# EAGLE design Own_RPi.Expansionboard.pro_1.0_Final_AR (EAGLE 9.6.2)
COMPANY: ADAFRUIT INDUSTRIES; DRAWN: KTOWN; REV: A; YEAR: 2019
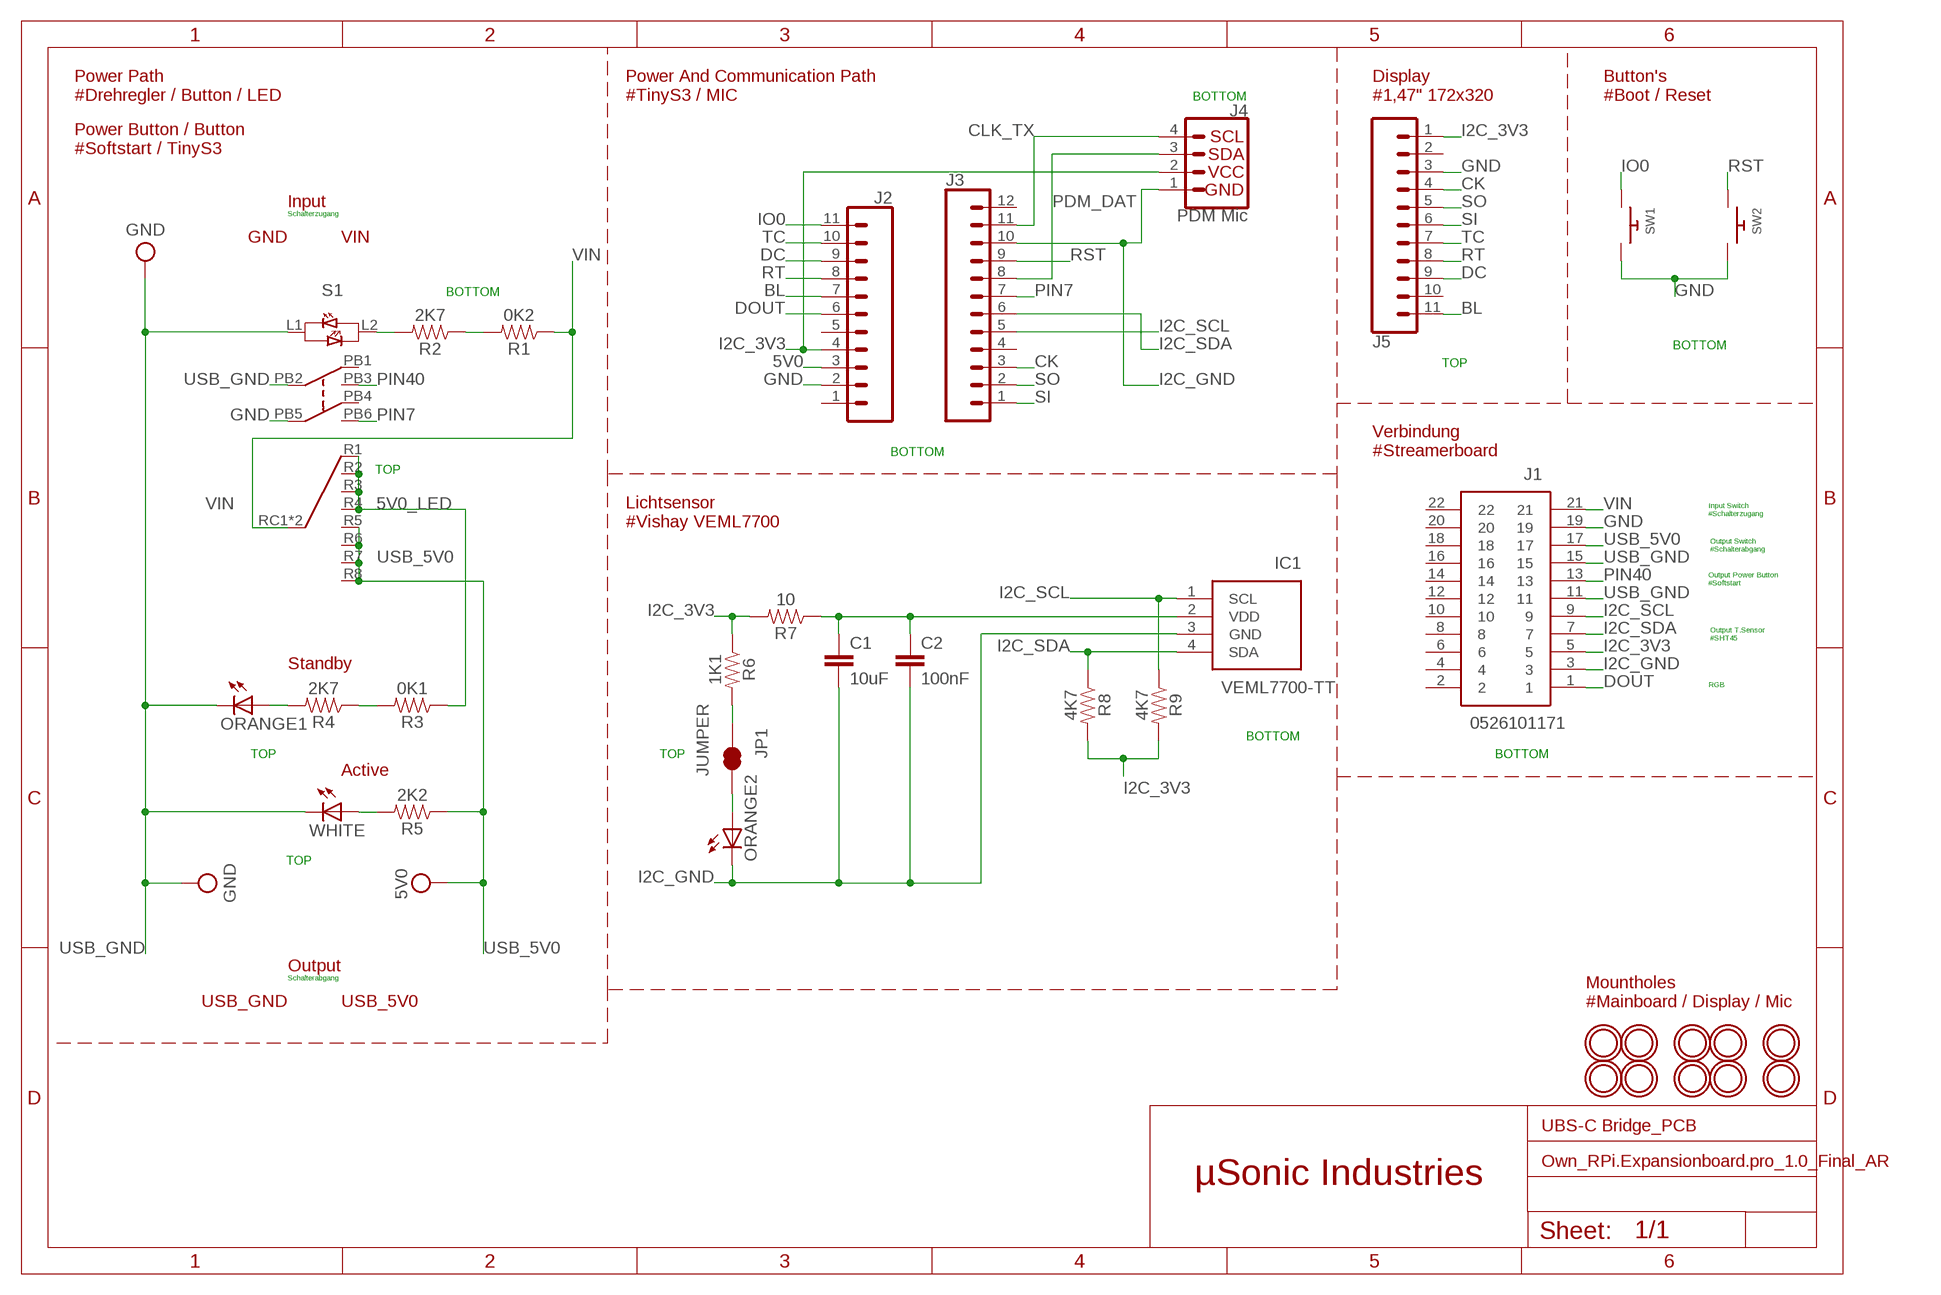
[diagram p0: schematic, sheet 1]

## Parts
C1  10uF  1.0UF-0805-25V-10%  [0805]
C2  100nF  1.0UF-0805-25V-10%  [0805]
IC1  VEML7700-TT  [VEML7700]
J1  0526101171  [0526101171]
J2  CONN_111X11_NO_SILK  [1X11_NO_SILK]
J3  CONN_12NO_SILK  [1X12_NO_SILK]
J4  PDM Mic  QWIIC_CONNECTOROWN  [JST04_1MM_VERT]
J5  CONN_111X11_NO_SILK  [1X11_NO_SILK]
JP1  JUMPER  JUMPER-SMT_2_NC_TRACE_SILK  [SMT-JUMPER_2_NC_TRACE_SILK]
ORANGE1  LEDCHIPLED_0805  [CHIPLED_0805]
ORANGE2  LEDCHIPLED_0805  [CHIPLED_0805]
R1  0K2  RESISTOR0805  [0805]
R2  2K7  RESISTOR0805  [0805]
R3  0K1  RESISTOR0805  [0805]
R4  2K7  RESISTOR0805  [0805]
R5  2K2  RESISTOR0805  [0805]
R6  1K1  RESISTOR0805  [0805]
R7  10  RESISTOR0805  [0805]
R8  4K7  RESISTOR0805  [0805]
R9  4K7  RESISTOR0805  [0805]
S1  481RV12172100  [481RV12172100]
SW1  SWITCH_PUSHBUTTONSF_OWN  [OWN_TACT_PANA-EVQ]
SW2  SWITCH_PUSHBUTTONSF_OWN  [OWN_TACT_PANA-EVQ]
U$1  MOUNTINGHOLE2.5  [MOUNTINGHOLE_2.5_PLATED]
U$2  MOUNTINGHOLE2.5  [MOUNTINGHOLE_2.5_PLATED]
U$3  MOUNTINGHOLE2.5  [MOUNTINGHOLE_2.5_PLATED]
U$5  MOUNTINGHOLE2.5  [MOUNTINGHOLE_2.5_PLATED]
U$8  MOUNTINGHOLE2.5  [MOUNTINGHOLE_2.5_PLATED]
U$9  MOUNTINGHOLE2.5  [MOUNTINGHOLE_2.5_PLATED]
U$13  MOUNTINGHOLE2.5  [MOUNTINGHOLE_2.5_PLATED]
U$14  MOUNTINGHOLE2.5  [MOUNTINGHOLE_2.5_PLATED]
U$15  MOUNTINGHOLE2.5  [MOUNTINGHOLE_2.5_PLATED]
U$16  MOUNTINGHOLE2.5  [MOUNTINGHOLE_2.5_PLATED]
WHITE  LEDCHIPLED_0805  [CHIPLED_0805]

## Nets
5V0: J2.3
5V0_LED: R3.1 S1.R1 S1.R2 S1.R3 S1.R4
BL: J2.7 J5.11
CK: J3.3 J5.4
CLK_TX: J3.11 J4.4
DC: J2.9 J5.9
DOUT: J1.1 J2.6
GND: J1.19 J2.2 J5.3 S1.PB5 SW1.P$2 SW2.P$2
I2C_3V3: J1.5 J2.4 J4.2 J5.1 R6.1 R7.2 R8.2 R9.2
I2C_GND: C1.2 C2.2 IC1.3(GND) J1.3 J3.10 J4.1 ORANGE2.C
I2C_SCL: IC1.1(SCL) J1.9 J3.5 R9.1
I2C_SDA: IC1.4(SDA) J1.7 J3.6 R8.1
IO0: J2.11 SW1.P$1
N$1: JP1.2 R6.2
N$2: R1.2 R2.1
N$3: R2.2 S1.L2
N$4: C1.1 C2.1 IC1.2(VDD) R7.1
N$5: R3.2 R4.1
N$6: R5.2 WHITE.A
N$7: ORANGE1.A R4.2
N$8: JP1.1 ORANGE2.A
PDM_DAT: J3.8 J4.3
PIN7: J3.7 S1.PB6
PIN40: J1.13 S1.PB3
RST: J3.9 SW2.P$1
RT: J2.8 J5.8
SI: J3.1 J5.6
SO: J3.2 J5.5
TC: J2.10 J5.7
USB_5V0: J1.17 R5.1 S1.R5 S1.R6 S1.R7 S1.R8 ; supply symbol labelled 5V0
USB_GND: J1.11 J1.15 ORANGE1.C S1.L1 S1.PB2 WHITE.C ; supply symbol labelled GND
VIN: J1.21 R1.1 S1.RC1(C1) S1.RC2(C1)
Unconnected: J1.2 J1.4 J1.6 J1.8 J1.10 J1.12 J1.14 J1.16 J1.18 J1.20 J1.22 J2.1 J2.5 J3.4 J3.12 J5.2 J5.10 S1.PB1 S1.PB4

## Notes on the sheet
- Power Path
  #Drehregler / Button / LED
- Power And Communication Path
  #TinyS3 / MIC
- BOTTOM
- Display
  #1,47" 172x320
- Button's
  #Boot / Reset
- Power Button / Button
  #Softstart / TinyS3
- Input
- Schalterzugang
- GND | VIN
- BOTTOM
- BOTTOM
- TOP
- BOTTOM
- Verbindung
  #Streamerboard
- TOP
- Input Switch
  #Schalterzugang
- Lichtsensor
  #Vishay VEML7700
- Output Switch
  #Schalterabgang
- Output Power Button
  #Softstart
- Output T.Sensor
  #SHT45
- Standby
- RGB
- BOTTOM
- TOP | TOP | BOTTOM
- Active
- TOP
- Output
- Schalterabgang
- USB_GND | USB_5V0
- Mountholes
  #Mainboard / Display / Mic
- UBS-C Bridge_PCB
- µSonic Industries

## Library data of the parts
C1 C2 = SparkFun-Capacitors:1.0UF: 1µF ceramic capacitors A capacitor is a passive two-terminal electrical component used to store electrical energy temporarily in an electric field.; PROD_ID: CAP-08064; VALUE: 1.0uF
IC1 = VEML7700-TT:VEML7700-TT: 16Bit Ambient Light Sensor I2C 6.8x2.3mm Source: Datasheet <https://www.arrow.com/en/products/veml7700-tt/vishay>; ARROW_PART_NUMBER: VEML7700-TT; ARROW_PRICE-STOCK: https://www.arrow.com/en/products/veml7700-tt/vishay?region=nac; DESCRIPTION: 16Bit Ambient Light Sensor I2C 6.8x2.3mm; HEIGHT: mm; MANUFACTURER_NAME: Vishay; MANUFACTURER_PART_NUMBER: VEML7700-TT; MOUSER_PART_NUMBER: 78-VEML7700-TT; MOUSER_PRICE-STOCK: https://www.mouser.co.uk/ProductDetail/Vishay-Semiconductors/VEML7700-TT?qs=BcfjnG7NVaXdL6DJFdWbdw%3D%3D
J1 = 0526101171mod:0526101171: Conn FFC/FPC Connector SKT 11 POS 1mm Solder ST SMD Easy-On T/R Source: Datasheet <https://www.molex.com/pdm_docs/sd/526101171_sd.pdf>; ARROW_PART_NUMBER: 0526101433; ARROW_PRICE-STOCK: https://www.arrow.com/en/products/0526101433/molex; DESCRIPTION: Conn FFC/FPC Connector SKT 14 POS 1mm Solder ST SMD Easy-On T/R; HEIGHT: 6.05mm; MANUFACTURER_NAME: Molex; MANUFACTURER_PART_NUMBER: 0526101433; MOUSER_PART_NUMBER: N/A; MOUSER_PRICE-STOCK: https://www.mouser.com/Search/Refine.aspx?Keyword=N%2FA
J2 J5 = SparkFun-Connectors2:CONN_11: Multi connection point. Often used as Generic Header-pin footprint for 0.1 inch spaced/style header connections On any of the 0.1 inch spaced packages, you can populate with these: Break Away Headers - Straight <https://www.sparkfun.com/products/116> (PRT-00116) Break Away Male Headers - Right Angle <https://www.sparkfun.com/products/553> (PRT-00553) Female Headers <https://www.sparkfun.com/products/115> (PRT-00115) Break Away Headers - Machine Pin <https://www.sparkfun.com/products/117> (PRT-00117) Break Away Female Headers - Swiss Machine Pin <https://www.sparkfun.com/products/743> (PRT-00743) For SCREWTERMINALS and SPRING TERMINALS visit here: Screw Terimnals on SparkFun.com <https://www.sparkfun.com/search/results?term=Screw+Terminals> (5mm/3.5mm/2.54mm spacing) This device is also useful as a general connection point to wire up your design to another part of your project. Our various solder wires solder well into these plated through hole pads. Hook-Up Wire - Assortment (Stranded, 22 AWG) <https://www.sparkfun.com/products/11375> (PRT-11375) Hook-Up Wire - Assortment (Solid Core, 22 AWG) <https://www.sparkfun.com/products/11367> (PRT-11367) View the entire wire category on our website here <https://www.sparkfun.com/categories/141>
J3 = SparkFun-Connectors2:CONN_12: Multi connection point. Often used as Generic Header-pin footprint for 0.1 inch spaced/style header connections On any of the 0.1 inch spaced packages, you can populate with these: Break Away Headers - Straight <https://www.sparkfun.com/products/116> (PRT-00116) Break Away Male Headers - Right Angle <https://www.sparkfun.com/products/553> (PRT-00553) Female Headers <https://www.sparkfun.com/products/115> (PRT-00115) Break Away Headers - Machine Pin <https://www.sparkfun.com/products/117> (PRT-00117) Break Away Female Headers - Swiss Machine Pin <https://www.sparkfun.com/products/743> (PRT-00743) For SCREWTERMINALS and SPRING TERMINALS visit here: Screw Terimnals on SparkFun.com <https://www.sparkfun.com/search/results?term=Screw+Terminals> (5mm/3.5mm/2.54mm spacing) This device is also useful as a general connection point to wire up your design to another part of your project. Our various solder wires solder well into these plated through hole pads. Hook-Up Wire - Assortment (Stranded, 22 AWG) <https://www.sparkfun.com/products/11375> (PRT-11375) Hook-Up Wire - Assortment (Solid Core, 22 AWG) <https://www.sparkfun.com/products/11367> (PRT-11367) View the entire wire category on our website here <https://www.sparkfun.com/categories/141> Special notes: Molex polarized connector foot print use with SKU : PRT-08231 with associated crimp pins and housings. 1MM SMD Version SKU: PRT-10208 NOTES ON THE VARIANTS LOCK and LOCK_LONGPADS... This footprint was designed to help hold the alignment of a through-hole component (i.e. 6-pin header) while soldering it into place. You may notice that each hole has been shifted either up or down by 0.005 of an inch from it's more standard position (which is a perfectly straight line). This slight alteration caused the pins (the squares in the middle) to touch the edges of the holes. Because they are alternating, it causes a "brace" to hold the component in place. 0.005 has proven to be the perfect amount of "off-center" position when using our standard breakaway headers. Although looks a little odd when you look at the bare footprint, once you have a header in there, the alteration is very hard to notice. Also,if you push a header all the way into place, it is covered up entirely on the bottom side.
J4 = SparkFun-Connectors2:QWIIC_CONNECTOR: SparkFun I2C Standard Qwiic Connector An SMD 1mm pitch JST connector makes it easy and quick (get it? Qwiic?) to connect I2C devices to each other. The Qwiic system <http://www.sparkfun.com/qwiic> enables fast and solderless connection between popular platforms and various sensors and actuators. We carry 200mm <https://www.sparkfun.com/products/14204>, 100mm <https://www.sparkfun.com/products/14205>, 50mm <https://www.sparkfun.com/products/14206>, and breadboard friendly <https://www.sparkfun.com/products/14207> Qwiic cables. We also offer 10 pcs strips <https://www.sparkfun.com/products/14323> the SMD connectors.; PROD_ID: CONN-14483; VALUE: Vertical Qwiic Connector
JP1 = SparkFun-Jumpers:JUMPER-SMT_2_NC_TRACE: Normally closed trace jumper This jumper has a trace between two pads so it's normally closed (NC). Use a razor knife to open the connection. For best results follow the IPC guidelines for cutting traces: Cutout at least 0.063 mm (0.005 in). Remove all loose material to clean up the cut area. Seal the cut with an approved epoxy. Reapply solder to reclose the connection.
ORANGE1 WHITE = adafruit:LED: LED OSRAM: - CHIPLED LG R971, LG N971, LY N971, LG Q971, LY Q971, LO R971, LY R971 LH N974, LH R974 LS Q976, LO Q976, LY Q976 LO Q996 - Hyper CHIPLED LW Q18S LB Q993, LB Q99A, LB R99A - SideLED LS A670, LO A670, LY A670, LG A670, LP A670 LB A673, LV A673, LT A673, LW A673 LH A674 LY A675 LS A676, LA A676, LO A676, LY A676, LW A676 LS A679, LY A679, LG A679 - Hyper Micro SIDELED® LS Y876, LA Y876, LO Y876, LY Y876 LT Y87S - SmartLED LW L88C, LW L88S LB L89C, LB L89S, LG L890 LS L89K, LO L89K, LY L89K LS L896, LA L896, LO L896, LY L896 - TOPLED LS T670, LO T670, LY T670, LG T670, LP T670 LSG T670, LSP T670, LSY T670, LOP T670, LYG T670 LG T671, LOG T671, LSG T671 LB T673, LV T673, LT T673, LW T673 LH T674 LS T676, LA T676, LO T676, LY T676, LB T676, LH T676, LSB T676, LW T676 LB T67C, LV T67C, LT T67C, LS T67K, LO T67K, LY T67K, LW E67C LS E67B, LA E67B, LO E67B, LY E67B, LB E67C, LV E67C, LT E67C LW T67C LS T679, LY T679, LG T679 LS T770, LO T770, LY T770, LG T770, LP T770 LB T773, LV T773, LT T773, LW T773 LH T774 LS E675, LA E675, LY E675, LS T675 LS T776, LA T776, LO T776, LY T776, LB T776 LHGB T686 LT T68C, LB T68C - Hyper Mini TOPLED® LB M676 - Mini TOPLED Santana® LG M470 LS M47K, LO M47K, LY M47K Source: http://www.osram.convergy.de/
ORANGE2 = adafruit2:LED: LED OSRAM: - CHIPLED LG R971, LG N971, LY N971, LG Q971, LY Q971, LO R971, LY R971 LH N974, LH R974 LS Q976, LO Q976, LY Q976 LO Q996 - Hyper CHIPLED LW Q18S LB Q993, LB Q99A, LB R99A - SideLED LS A670, LO A670, LY A670, LG A670, LP A670 LB A673, LV A673, LT A673, LW A673 LH A674 LY A675 LS A676, LA A676, LO A676, LY A676, LW A676 LS A679, LY A679, LG A679 - Hyper Micro SIDELED® LS Y876, LA Y876, LO Y876, LY Y876 LT Y87S - SmartLED LW L88C, LW L88S LB L89C, LB L89S, LG L890 LS L89K, LO L89K, LY L89K LS L896, LA L896, LO L896, LY L896 - TOPLED LS T670, LO T670, LY T670, LG T670, LP T670 LSG T670, LSP T670, LSY T670, LOP T670, LYG T670 LG T671, LOG T671, LSG T671 LB T673, LV T673, LT T673, LW T673 LH T674 LS T676, LA T676, LO T676, LY T676, LB T676, LH T676, LSB T676, LW T676 LB T67C, LV T67C, LT T67C, LS T67K, LO T67K, LY T67K, LW E67C LS E67B, LA E67B, LO E67B, LY E67B, LB E67C, LV E67C, LT E67C LW T67C LS T679, LY T679, LG T679 LS T770, LO T770, LY T770, LG T770, LP T770 LB T773, LV T773, LT T773, LW T773 LH T774 LS E675, LA E675, LY E675, LS T675 LS T776, LA T776, LO T776, LY T776, LB T776 LHGB T686 LT T68C, LB T68C - Hyper Mini TOPLED® LB M676 - Mini TOPLED Santana® LG M470 LS M47K, LO M47K, LY M47K Source: http://www.osram.convergy.de/
R1-R9 = SparkFun-Resistors:RESISTOR: Generic Resistor Package
S1 = Eagle_WS-RPTL (rev20a):481RV12172100: WS-RPTL THT Illuminated Rotary Push Button Switch PROPERTIES: Diffuser Plate:PC Diffuser Plate Flammability Rating:UL94 HB Knob:PA66 Knob Flammability Rating:UL94 HB Frame Material:PA66 Frame Flammability Rating:UL94 HB Base Material:PA66 Base Flammability Rating:UL94 HB Stationary Board:PA66 Stationary Board Flammability Rating:UL94 HB Stationary Contact Plating:Silver Moveable Contact Push Button Plating:Silver Moveable Contact Rotary Plating:Silver Spring Material:Stainless Steel Terminal Plating:Silver Contact Resistance:50 mΩ RISO:100 MΩ Withstanding Voltage:500 V (AC) Switching Schematic Rotary:1P8T Qty.:77 Material Properties: Cover Material:Stainless Steel Mechanical Properties: Operation Force:250 g Switching Schematic Pushbutton:DPDT Switching Schematic Rotary:1P8T General Information: Operating Temperature:-40 up to +85 °C Packaging Properties: Packaging:ESD Tray <https://www.we-online.com/catalog/media/o41281v209%20Family_WS-RPTL_20x20_Button_Switch.jpg> Details see: https://www.we-online.com/catalog/en/RPTL_20X20_THT_ROTARY_PUSH_BUTTON_SWITCH/ Updated by Yingchun Shan,2020-02-26 2020(C) Wurth Elektronik; DATASHEET-URL: https://www.we-online.com/catalog/datasheet/481RV12172100.pdf; EMITTING-COLOR: Red&Bright Green; H: 14.15mm; PART-NUMBER: 481RV12172100
SW1 SW2 = adafruit2:SWITCH_PUSHBUTTON: Buttons SOFTTOUCHSMD_SJ - Soft touch temporary push button (Super Junk Akihabara) Compatible with SKPMANE010 [Mouser: 688-SKPMAN] C&K_KSS = Digikey: KSS221GLFS
U$1-U$3 U$5 U$8 U$9 U$13-U$16 = microbuilder:MOUNTINGHOLE: Mounting Hole For #2 screws (0.086"/2.18mm width, 0.094"/2.4mm hole) use 2.5mm; BOM: EXCLUDE

## Net classes
0 default: width 0.25 mm

## Board
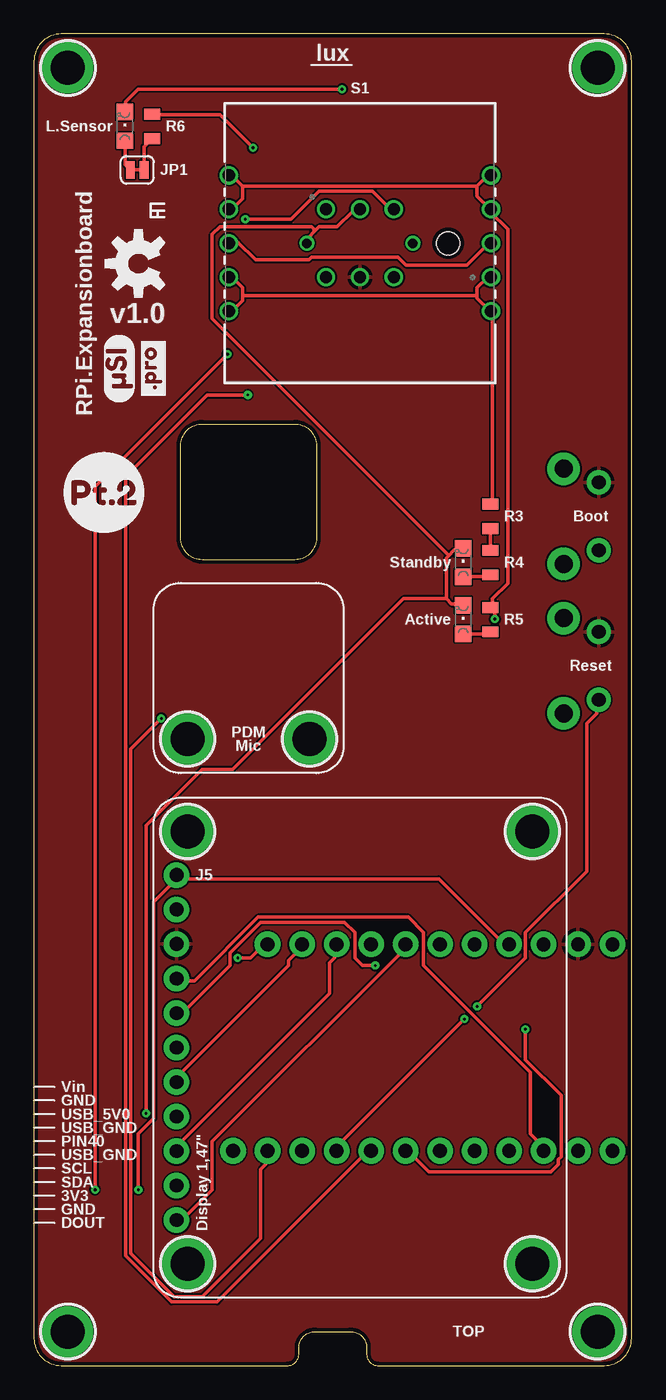
[diagram p1: board, top side]
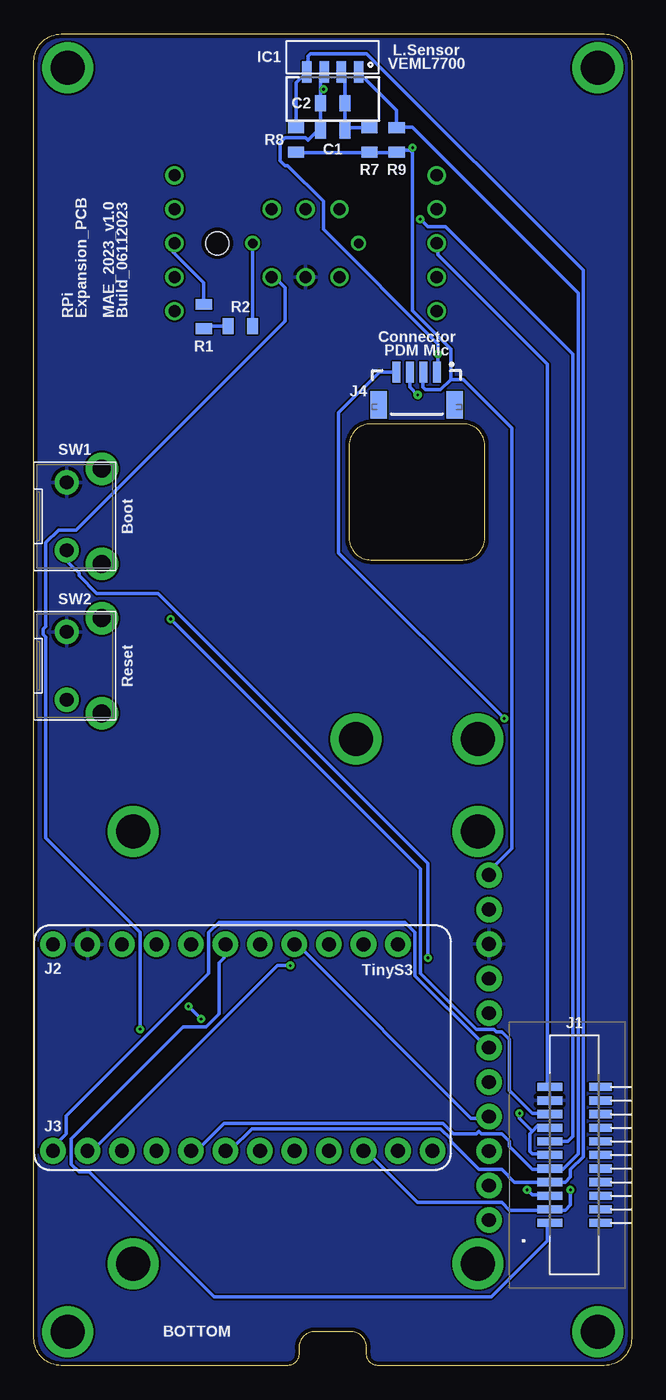
[diagram p2: board, bottom side, seen from below]

Size 44 x 98 mm. Coordinates in mm from the lower left corner, seen from the top.
Outline: 44,2 44,96 arc90 42,98 2,98 arc90 0,96 0,2 arc90 2,0 18.7,0 arc90 19.5,0.8 19.5,1.3 arc-90 20.7,2.5 23.3,2.5 arc-90 24.5,1.3 24.5,0.8 arc90 25.3,0 42,0 arc90 44,2
Outline: 19.2,59.3 12.4,59.3 arc-90 10.8,60.9 10.8,67.7 arc-90 12.4,69.3 19.2,69.3 arc-90 20.8,67.7 20.8,60.9 arc-90 19.2,59.3
Copper layers (1*16): Top 0.035mm / dielectric 1.5mm / Bottom 0.035mm
Design rules "aisler_2_layer_complex *": minimum track width 0.125mm, minimum drill 0.2mm, track to track 0.125mm, track to pad 0.125mm, pad to pad 0.125mm, via to via 0.125mm, smd to smd 0.125mm, copper to edge 0.3mm, drill to drill 0.25mm, minimum pad ring 0.2mm, minimum via ring 0.2mm, stop-mask expansion 0mil, vias tented up to drill 0mil, thermal gap 10mil

### Footprints (pad centres in the part's own frame; a part is rotated, then mirrored left to right if it is on the bottom)
0805 = smd 0.8 x 1.2: 1 -0.9,0; 2 0.9,0
VEML7700 = smd 0.7 x 1.6: 1 1.495,-0.4; 2 2.765,-0.4; 3 4.035,-0.4; 4 5.305,-0.4
0526101171 = smd 0.6 x 1.85: 1 -5,1.825; 3 -4,1.825; 5 -3,1.825; 7 -2,1.825; 9 -1,1.825; 11 0,1.825; 13 1,1.825; 15 2,1.825; 17 3,1.825; 19 4,1.825; 21 5,1.825 | smd 0.6 x 1.65: 2 -5,-1.925; 4 -4,-1.925; 6 -3,-1.925; 8 -2,-1.925; 10 -1,-1.925; 12 0,-1.925; 14 1,-1.925; 16 2,-1.925; 18 3,-1.925; 20 4,-1.925; 22 5,-1.925
1X11_NO_SILK = drill 1.016 pad 1.88: 1 0,0; 2 2.54,0; 3 5.08,0; 4 7.62,0; 5 10.16,0; 6 12.7,0; 7 15.24,0; 8 17.78,0; 9 20.32,0; 10 22.86,0; 11 25.4,0
1X12_NO_SILK = drill 1.016 pad 1.88: 1 0,0; 2 2.54,0; 3 5.08,0; 4 7.62,0; 5 10.16,0; 6 12.7,0; 7 15.24,0; 8 17.78,0; 9 20.32,0; 10 22.86,0; 11 25.4,0; 12 27.94,0
JST04_1MM_VERT = smd 0.6 x 1.55: 1 -1.478,0.775; 2 -0.478,0.775; 3 0.522,0.775; 4 1.522,0.775 | smd 1.2 x 2: NC1 -2.778,3.2; NC2 2.822,3.2
SMT-JUMPER_2_NC_TRACE_SILK = smd 0.635 x 1.27: 1 -0.508,0; 2 0.508,0
CHIPLED_0805 = smd 1.2 x 1.2: A 0,-1.05; C 0,1.05
481RV12172100 = drill 0.7: L1 -3.9,0; L2 3.9,0 | drill 0.9: PB1 -2.5,2.5; PB2 0,2.5; PB3 2.5,2.5; PB4 -2.5,-2.5; PB5 0,-2.5; PB6 2.5,-2.5; R1 9.65,-2.5; R2 9.65,-5; R3 -9.65,-5; R4 -9.65,-2.5; R5 -9.65,2.5; R6 -9.65,5; R7 9.65,5; R8 9.65,2.5; RC1 9.65,0; RC2 -9.65,0 | hole 1.7: 6.5,0
OWN_TACT_PANA-EVQ = drill 1.016 pad 1.778: P$1 -2.5,0.58; P$2 2.5,0.58 | drill 1.321 pad 2.413: P$3 -3.5,-2; P$4 3.5,-2
MOUNTINGHOLE_2.5_PLATED = drill 2.5 pad 3.2: P$1 0,0

### Placement (x,y rotation side)
C1  22,90.9 180 bottom
C2  22,92.9 180 bottom
IC1  18.6,94.8 180 bottom
J1  4.2,15.5 90 bottom
J2  42.6,31 180 top
J3  42.6,15.8 180 top
J4  15.8,73.9 180 bottom
J5  10.5,36.1 270 top
JP1  7.6,88 0 top
ORANGE1  31.6,59.1 0 top
ORANGE2  6.7,91.2 0 top
R1  31.5,77.2 270 bottom
R2  28.8,76.5 0 bottom
R3  33.6,62.5 270 top
R4  33.6,59.1 270 top
R5  33.6,54.9 270 top
R6  8.7,91.2 270 top
R7  19.3,90.2 270 bottom
R8  24.7,90.2 270 bottom
R9  17.3,90.2 270 bottom
S1  24,82.6 0 top
SW1  41,62.5 90 bottom
SW2  41,51.5 90 bottom
U$1  20.3,46.1 180 top
U$2  11.3,46.1 180 top
U$3  11.3,39.3 0 top
U$4  [PT.2]  2.2,61.3 0 top
U$5  36.7,39.3 0 top
U$8  36.7,7.5 0 top
U$9  11.3,7.5 0 top
U$10  [.PRO_LARGE]  9.7,71.4 90 top
U$11  [µSI_LARGE]  7.4,70.9 90 top
U$12  [OSHW-LOGO-M]  7.7,81.1 90 top
U$13  41.5,2.5 0 top
U$14  2.5,95.5 0 top
U$15  41.5,95.5 0 top
U$16  2.5,2.5 0 top
WHITE  31.6,54.9 0 top

### Tracks (layer width: path | path; a pad name or v marks a point on that pad's centre or on a via)
5V0_LED
  Top 0.25: 15.38,78.75 15.38,79.31 14.44,80.25 S1.R4 | 15.38,78.75 15.38,78.38 14.62,77.62 14.44,77.62 S1.R3 | R3.1 33.75,63.56 33.75,77.44 S1.R2 33.56,77.62 32.62,78.56 32.62,78.75 | 32.62,78.75 32.62,79.31 33.38,80.06 33.56,80.06 S1.R1 | 32.62,78.75 15.38,78.75
BL
  Top 0.25: J5.11 10.5,10.88 11.06,10.88 13.12,12.94 13.12,16.5 27.19,30.56 27.19,30.94 J2.7
CK
  Top 0.25: J5.4 10.5,28.31 11.81,28.31 16.5,33 27.56,33 28.69,31.88 28.69,29.44 36.56,21.56 36.56,17.06 37.69,15.94 J3.3
CLK_TX  (via drill 0.2)
  Top 0.25: v9.38,47.62 7.12,45.38 7.12,8.25 10.31,5.06 12.38,5.06 16.69,9.38 16.69,14.44 17.06,14.81 17.06,15.75 J3.11
  Bottom 0.25: J4.4 18.56,73.12 21.56,70.12 21.56,59.81 v9.38,47.62
DC
  Top 0.25: J5.9 10.5,15.94 10.88,16.31 10.88,16.5 21.75,27.38 21.75,29.62 22.12,30 22.12,30.94 J2.9
DOUT
  Bottom 0.25: J1.1 6.19,10.5 6.19,9.19 10.31,5.06 30.75,5.06 39.94,14.25 40.69,14.25 41.25,14.81 41.25,16.69 33,24.94 31.31,24.94 30.38,25.88 30.38,29.62 30,30 30,30.94 J2.6
GND
  pour Top: 0,0 0,98 44,98 44,0
  pour Bottom: 0,0 0,98 44,98 44,0
I2C_3V3  (via drill 0.2)
  Top 0.25: v16.12,89.62 13.69,92.06 8.81,92.06 R6.1 | v7.69,12.94 7.69,17.06 8.81,18.19 8.81,34.12 10.5,35.81 | 10.5,35.81 J5.1 10.5,36 | 10.5,35.81 29.81,35.81 34.5,31.12 34.88,31.12 J2.4
  Bottom 0.25: 16.31,89.44 17.25,89.44 R9.2 17.44,89.25 19.12,89.25 R7.2 19.31,89.25 24.56,89.25 R8.2 | 13.31,72.56 14.06,71.81 15.19,71.81 15.38,72 15.38,73.12 J4.2 | 13.31,72.56 13.31,74.81 16.12,77.62 16.12,89.25 16.31,89.44 | 16.31,89.44 v16.12,89.62 | v7.69,12.94 7.31,12.56 6.19,12.56 J1.5 | 13.31,72.56 12.38,72.56 8.81,69 8.81,38.06 10.5,36.38 J5.1
I2C_GND  (via drill 0.2)
  Top 0.25: v22.69,93.94 7.69,93.94 6.75,93 6.75,92.25 ORANGE2.C | v4.5,12.94 4.5,64.69 v14.25,74.44
  Bottom 0.25: 22.9,93.94 C2.2 C1.2 23.06,90.94 23.81,90.19 24,90.38 25.5,90.38 25.88,90 25.88,88.69 25.5,88.31 25.31,88.31 22.69,85.69 22.69,83.62 14.25,75.19 v14.25,74.44 14.25,73.12 J4.1 | 22.9,93.94 22.9,94.94 IC1.3 | J3.10 19.69,15.94 15.75,12 9.56,12 9,11.44 6.19,11.44 J1.3 6,11.44 4.88,11.44 4.5,11.81 v4.5,12.94 | 22.9,93.94 v22.69,93.94
I2C_SCL
  Bottom 0.25: IC1.1 17.3,92.41 R9.1 17.25,91.12 16.12,91.12 3.94,78.94 3.94,15.56 5.06,14.44 6,14.44 J1.9 6.19,14.44 7.31,14.44 9,16.12 9,16.5 9.56,17.06 11.06,17.06 11.25,17.25 11.44,17.06 13.12,17.06 13.88,17.81 30,17.81 31.88,15.94 32.44,15.94 J3.5
I2C_SDA
  Bottom 0.25: R8.1 24.7,94.41 IC1.4 23.81,95.25 23.81,96.38 23.62,96.56 19.5,96.56 3.56,80.62 3.56,15.38 4.5,14.44 4.5,13.88 4.88,13.5 J1.7 8.62,13.5 9.56,14.44 11.25,14.44 13.31,16.5 13.31,16.69 14.06,17.44 27.94,17.44 29.44,15.94 29.81,15.94 J3.6
IO0  (via drill 0.2)
  Top 0.25: v15,30 15.94,30 17.06,31.12 J2.11
  Bottom 0.25: v15,30 15,36.94 34.88,56.81 39.38,56.81 40.69,58.12 40.69,58.31 41.44,59.06 41.44,60 SW1.P$1
N$1
  Top 0.25: JP1.2 8.11,89.71 R6.2
N$2
  Bottom 0.25: R2.1 31.3,76.5 R1.2
N$3
  Bottom 0.25: R2.2 S1.L2
N$4
  Bottom 0.25: R7.1 20.9,91.1 C1.1 C2.1 21.1,94.94 IC1.2
N$5
  Top 0.25: R4.1 R3.2
N$6
  Top 0.25: R5.2 33.45,53.85 WHITE.A
N$7
  Top 0.25: R4.2 33.45,58.05 ORANGE1.A
N$8
  Top 0.25: JP1.1 6.7,88.39 ORANGE2.A
PDM_DAT  (via drill 0.2)
  Top 0.25: v15.75,71.44 12.75,71.44 6.75,65.44 6.75,8.06 10.12,4.69 13.5,4.69 24.75,15.94 J3.8
  Bottom 0.25: v15.75,71.44 16.31,72 J4.3
PIN7  (via drill 0.2)
  Top 0.25: v36.19,24.75 36.19,22.5 38.81,19.88 38.81,15.38 38.62,15.19 38.62,14.81 38.06,14.25 29.06,14.25 27.38,15.94 J3.7
  Bottom 0.25: v36.19,24.75 36.19,31.88 43.12,38.81 43.12,53.62 43.31,53.81 43.31,54.19 43.12,54.38 43.12,60.56 42.19,61.5 40.88,61.5 25.5,76.88 25.5,79.31 26.25,80.06 26.44,80.06 S1.PB6
PIN40  (via drill 0.2)
  Top 0.25: v15.56,84.38 18.94,84.38 21,86.44 24.94,86.44 26.44,84.94 S1.PB3
  Bottom 0.25: J1.13 4.69,16.5 4.31,16.88 4.31,74.44 13.69,83.81 15,83.81 v15.56,84.38
RST  (via drill 0.2)
  Top 0.25: v32.62,26.44 36.19,30 36.19,31.88 40.69,36.38 40.69,47.25 41.44,48 41.44,48.94 SW2.P$1 | v31.69,25.5 22.12,15.94 J3.9
  Bottom 0.25: v31.69,25.5 v32.62,26.44
RT
  Bottom 0.25: J5.8 10.5,18.19 11.81,18.19 24.75,31.12 J2.8
SI
  Bottom 0.25: J5.6 10.5,23.44 10.88,23.81 11.06,23.81 15.94,28.69 15.94,31.88 16.69,32.62 30.38,32.62 31.12,31.88 31.12,28.88 41.62,18.38 41.62,17.06 42.75,15.94 J3.1
SO  (via drill 0.2)
  Top 0.25: v25.12,29.44 24.19,29.44 23.62,30 23.62,31.88 22.88,32.62 16.69,32.62 14.44,30.38 14.44,29.44 11.06,26.06 10.5,26.06 J5.5
  Bottom 0.25: v25.12,29.44 26.06,29.44 39.56,15.94 39.94,15.94 J3.2
TC
  Top 0.25: J5.7 10.5,21 10.88,21.38 10.88,21.56 18.75,29.44 18.75,29.81 19.88,30.94 J2.10
USB_5V0  (via drill 0.2)
  Top 0.25: 15.38,86.81 15.38,85.88 14.62,85.12 14.44,85.12 S1.R5 | 15.38,86.81 14.44,87.75 S1.R6 | 33.75,55.88 33.75,56.44 34.88,57.56 34.88,83.62 33.56,84.94 S1.R8 33.56,85.12 32.62,86.06 32.62,86.81 | v33.94,54.94 33.94,55.69 33.75,55.88 | 33.75,55.88 R5.1 | 32.62,86.81 33.38,87.56 33.56,87.56 S1.R7 | 32.62,86.81 15.38,86.81
  Bottom 0.25: v33.94,54.94 15.56,36.56 15.56,28.88 11.44,24.75 10.12,24.75 9.94,24.56 9.56,24.56 9,24 9,20.25 7.31,18.56 6.19,18.56 J1.17
USB_GND  (via drill 0.2)
  Top 0.25: 20.62,83.44 21,83.81 22.31,83.81 23.44,84.94 24,84.94 S1.PB2 | 20.62,83.44 20.25,83.06 20.25,82.69 S1.L1 | 30.38,56.44 30.75,56.06 31.5,56.06 WHITE.C | 30.38,56.44 30.38,59.44 30.56,59.62 | 30.56,59.62 30.94,60 31.5,60 ORANGE1.C | v8.25,18.56 8.25,39.75 12.38,43.88 14.62,43.88 27.19,56.44 30.38,56.44 | 20.62,83.44 20.62,83.62 20.44,83.81 13.69,83.81 13.12,83.25 13.12,77.06 30.56,59.62
  Bottom 0.25: 7.31,17.25 6.94,17.62 6.19,17.62 J1.15 | 7.31,17.25 7.5,17.06 7.5,15.75 7.31,15.56 6.19,15.56 J1.11 | 7.31,17.25 8.25,18.19 v8.25,18.56
VIN
  Top 0.25: S1.RC1 33.56,82.5 33.38,82.5 31.88,81 27.38,81 26.81,81.56 20.44,81.56 20.25,81.38 16.31,81.38 15,82.69 14.44,82.69 S1.RC2
  Bottom 0.25: R1.1 31.5,79.69 33.75,81.94 33.75,82.5 S1.RC1 | J1.21 6.19,20.62 6.19,73.69 14.25,81.75 14.25,82.5 S1.RC2

### Text on the board
tPlace: lux | S1 | L.Sensor | R6 | JP1 | v1.0 | RPi.Expansionboard | R3 | Boot | Standby | R4 | Active | R5 | Reset | PDM / Mic | J5 | Vin / GND / USB_5V0 / USB_GND / PIN40 / USB_GND / SCL / SDA / 3V3 / GND / DOUT | Display 1,47" | TOP
bPlace: L.Sensor / VEML7700 | IC1 | C2 | C1 | R8 | R9 | R7 | R2 | RPi / Expansion_PCB / / MAE_2023_v1.0 / Build_06112023 | R1 | Connector / PDM Mic | J4 | SW1 | Boot | SW2 | Reset | J2 | TinyS3 | J1 | J3 | BOTTOM